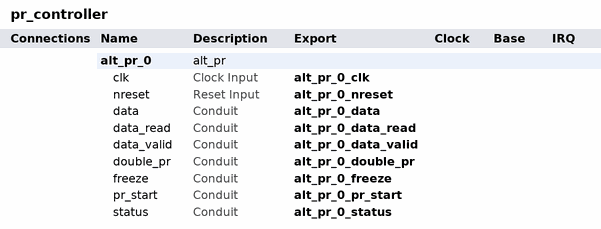
[diagram p0: system contents]
# Platform Designer (Qsys) system pr_controller, Stratix V 5SGXMA7H2F35C2
# Parameters at their usual value, and those the tool derives, are not listed.
package require qsys
create_system pr_controller
set_project_property DEVICE_FAMILY {Stratix V}
set_project_property DEVICE 5SGXMA7H2F35C2

add_instance alt_pr_0 alt_pr 13.1
set_instance_parameter_value alt_pr_0 PR_INTERNAL_HOST true
set_instance_parameter_value alt_pr_0 ENABLE_JTAG true
set_instance_parameter_value alt_pr_0 DATA_WIDTH_INDEX 32
set_instance_parameter_value alt_pr_0 CDRATIO 1
set_instance_parameter_value alt_pr_0 EDCRC_OSC_DIVIDER 1

# exported interfaces
add_interface alt_pr_0_pr_start conduit end
set_interface_property alt_pr_0_pr_start EXPORT_OF alt_pr_0.pr_start
add_interface alt_pr_0_double_pr conduit end
set_interface_property alt_pr_0_double_pr EXPORT_OF alt_pr_0.double_pr
add_interface alt_pr_0_data_valid conduit end
set_interface_property alt_pr_0_data_valid EXPORT_OF alt_pr_0.data_valid
add_interface alt_pr_0_freeze conduit end
set_interface_property alt_pr_0_freeze EXPORT_OF alt_pr_0.freeze
add_interface alt_pr_0_data conduit end
set_interface_property alt_pr_0_data EXPORT_OF alt_pr_0.data
add_interface alt_pr_0_data_read conduit end
set_interface_property alt_pr_0_data_read EXPORT_OF alt_pr_0.data_read
add_interface alt_pr_0_status conduit end
set_interface_property alt_pr_0_status EXPORT_OF alt_pr_0.status
add_interface alt_pr_0_clk clock sink
set_interface_property alt_pr_0_clk EXPORT_OF alt_pr_0.clk
add_interface alt_pr_0_nreset reset sink
set_interface_property alt_pr_0_nreset EXPORT_OF alt_pr_0.nreset

set_interconnect_requirement {$system} qsys_mm.clockCrossingAdapter HANDSHAKE
set_interconnect_requirement {$system} qsys_mm.maxAdditionalLatency 1
set_interconnect_requirement {$system} qsys_mm.insertDefaultSlave false

save_system pr_controller.qsys
